# Altium project KSDK.PrjPCB
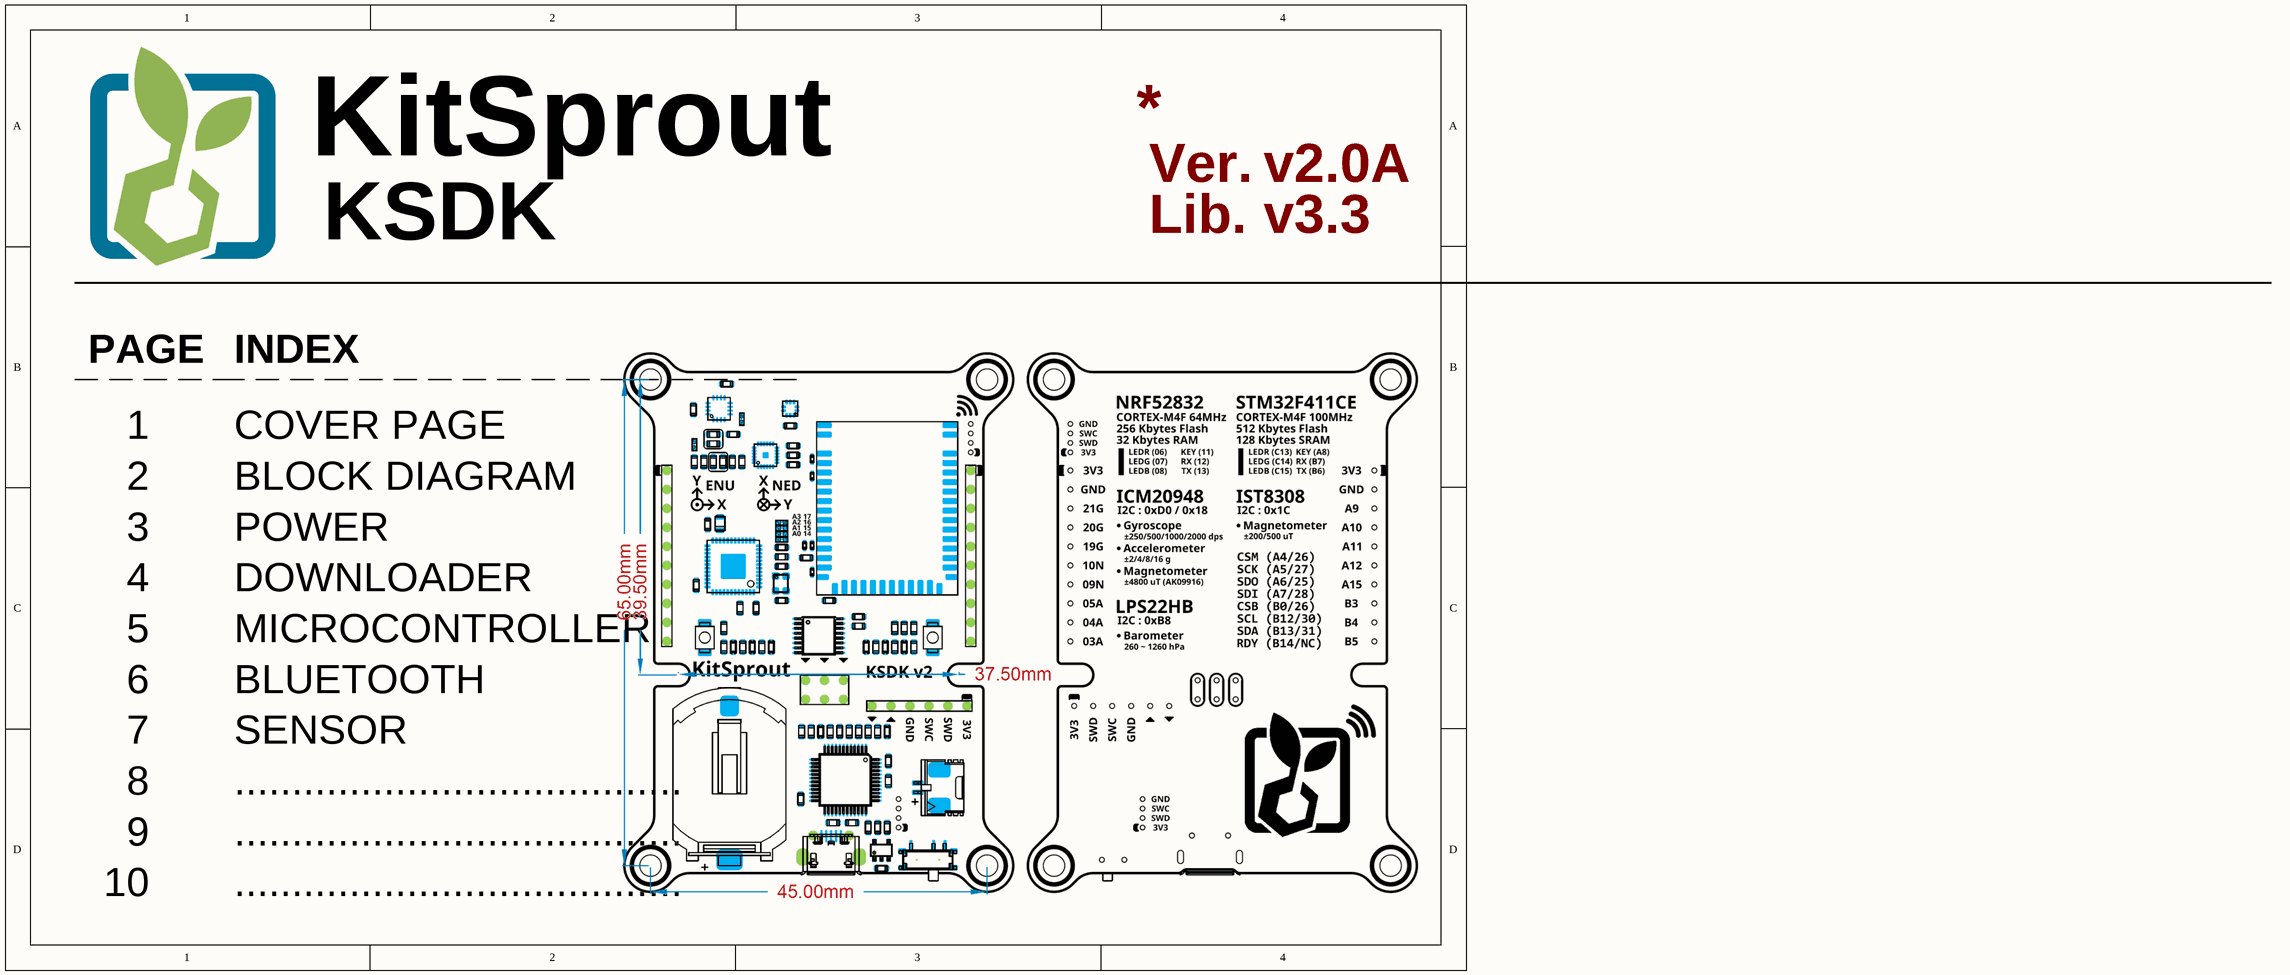
[diagram p0: [01] COVER PAGE.SchDoc]
7 sheets, 93 parts. Net scope: flat (ports and power ports of the same name join across sheets).
Board file: KSDK.PcbDoc
Sheets:
  [01] COVER PAGE.SchDoc
  [02] BLOCK DIAGRAM.SchDoc
    LDO = [03] POWER.SchDoc
    INERTIAL SENSOR = [07] SENSOR.SchDoc
    STM32 = [05] MICROCONTROLLER.SchDoc
    NRF52 = [06] BLUETOOTH.SchDoc
    DOWNLOADER = [04] DOWNLOADER.SchDoc

## Sheet [01] COVER PAGE.SchDoc: KSDK
size A4; Author: Hom; CompanyName: KitSprout; DrawnBy: Hom; Engineer: Hom; Organization: KitSprout; Revision: A; SheetNumber: 1; SheetTotal: 2; Version: v2.0A; LibVersion: v3.3

### Notes on the sheet
- Ver.
- ________________________________________________________________________
- Lib.
- _ _ _ _ _
- PAGE
- _ _ _ _ _ _ _ _ _ _ _ _ _ _ _ _ _
- INDEX
- 1
- COVER PAGE
- 2
- 3
- BLOCK DIAGRAM
- POWER
- 4
- DOWNLOADER
- 5
- MICROCONTROLLER
- 6
- BLUETOOTH
- 7
- 8
- SENSOR
- .......................................
- 9
- 10

## Sheet [02] BLOCK DIAGRAM.SchDoc: Template
size A4; Author: Hom; CompanyName: KitSprout; DrawnBy: Hom; Engineer: Hom; Organization: KitSprout; Revision: A; SheetNumber: 2; SheetTotal: 1; Version: 0.0; LibVersion: 0.0
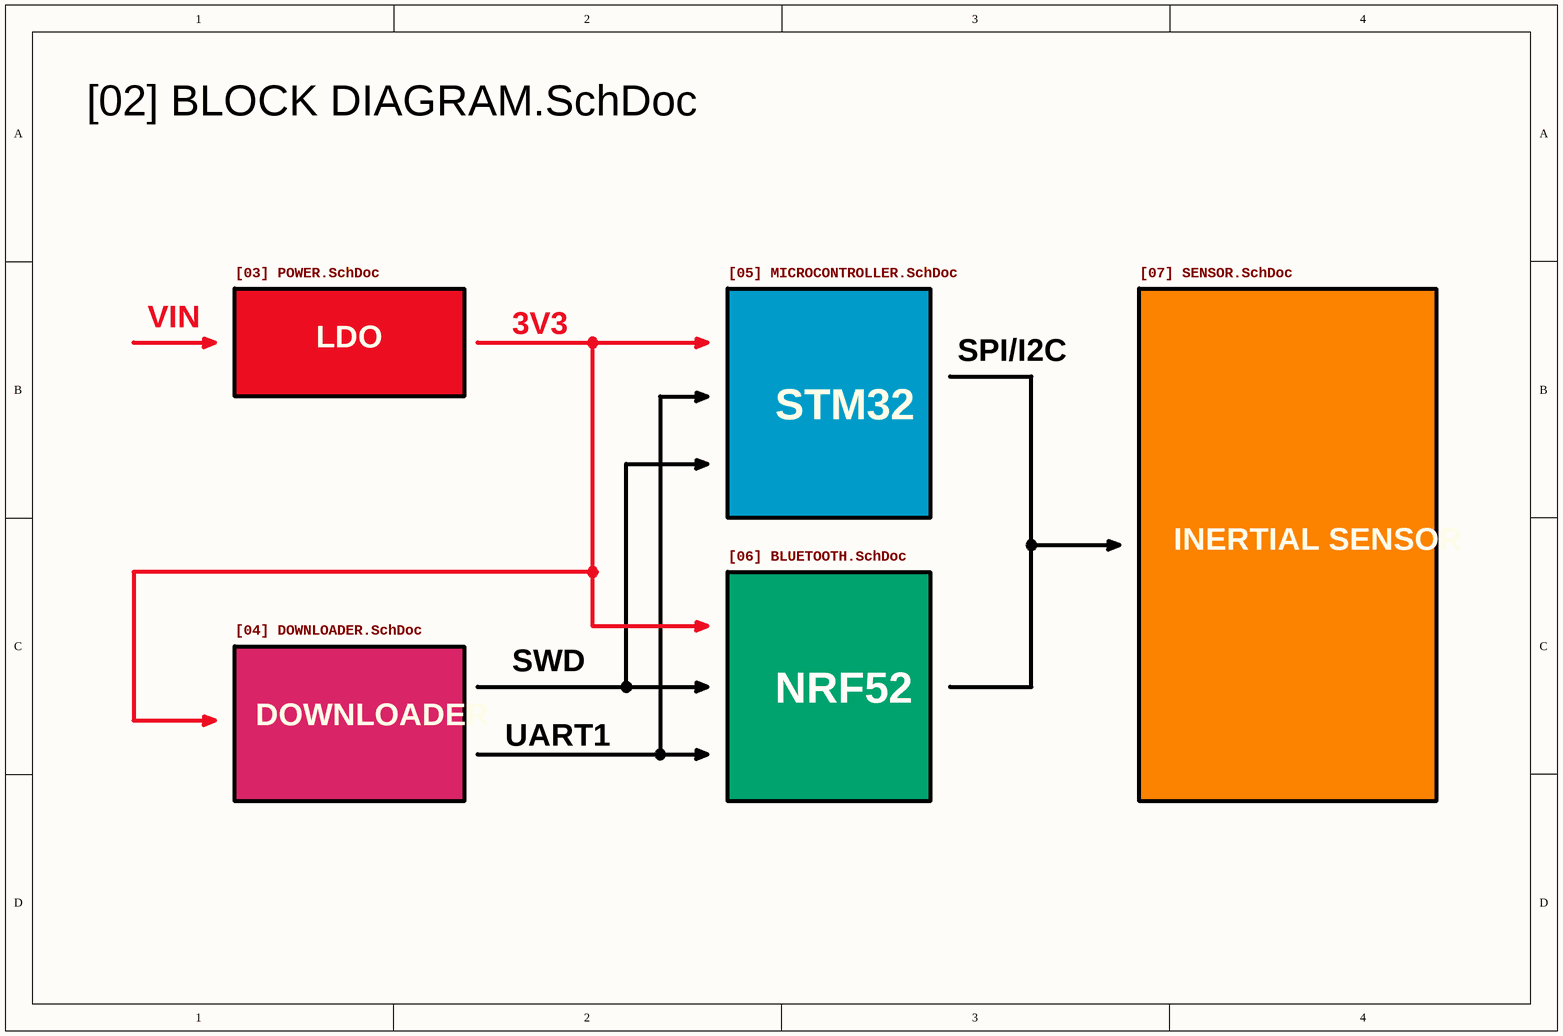
[diagram p1: [02] BLOCK DIAGRAM.SchDoc]

### Sub-sheets
DOWNLOADER = [04] DOWNLOADER.SchDoc: no entries
INERTIAL SENSOR = [07] SENSOR.SchDoc: no entries
LDO = [03] POWER.SchDoc: no entries
NRF52 = [06] BLUETOOTH.SchDoc: no entries
STM32 = [05] MICROCONTROLLER.SchDoc: no entries

### Notes on the sheet
- VIN
- 3V3
- SPI/I2C
- SWD
- UART1

## Sheet [03] POWER.SchDoc: Template
size A4; Author: Hom; CompanyName: KitSprout; DrawnBy: Hom; Engineer: Hom; Organization: KitSprout; Revision: A; SheetNumber: 3; SheetTotal: 6; Version: 0.0; LibVersion: 0.0
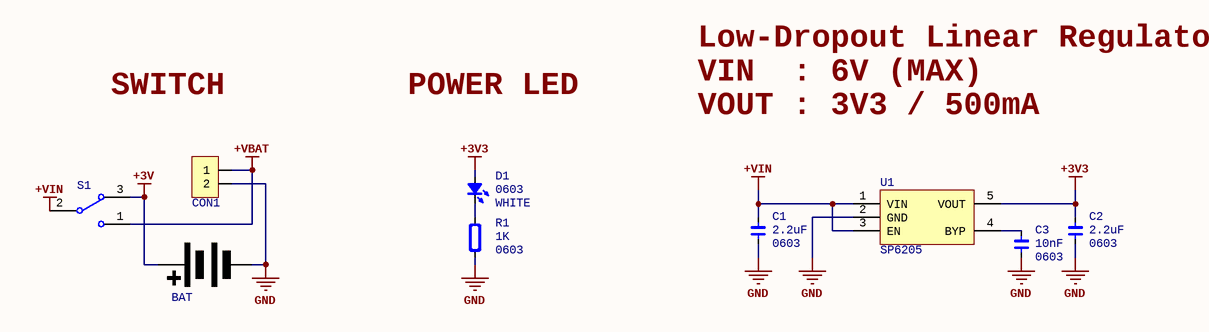
[diagram p2: [03] POWER.SchDoc]

### Parts
BAT  Battery  [CR2032-1]  (value not drawn)
C1  Type: 0603  [CAP_0603]  (hidden comment: 2.2uF)
C2  Type: 0603  [CAP_0603]  (hidden comment: 2.2uF)
C3  Type: 0603  [CAP_0603]  (hidden comment: 10nF)
CON1  MX1.25_2P  [MX1.25_S90_2P]  (value not drawn)
D1  Type: 0603  [LED_0603_YELLOW]  (hidden comment: WHITE)
R1  Type: 0603  [RES_0603]  (hidden comment: 1K)
S1  SPDT 3P  [SwitchSPDT_2.8X6.6_90]  (value not drawn)
U1  SP6205  [SOT23-5]

### Nets
+3V: BAT.2(+) S1.3
+3V3: C2.2 D1.1(A) U1.5(VOUT)
+VBAT: CON1.1 S1.1
+VIN: C1.2 S1.2 U1.1(VIN) U1.3(EN)
GND: BAT.1(-) C1.1 C2.1 C3.1 CON1.2 R1.1 U1.2(GND)
NetC3_2: C3.2 U1.4(BYP)
NetD1_2: D1.2(K) R1.2

### Notes on the sheet
- Low-Dropout Linear Regulator
- SWITCH
- POWER LED
- VIN  : 6V (MAX)
- VOUT : 3V3 / 500mA

### Library data of the parts
C1-C3 = Cap_0603: Capacitor
  C1 C2: Value: 2.2uF
  C3: Value: 10nF
CON1 = MX1.25_2P: MX
D1 = LED_0603: LED; Value: WHITE
R1 = Res_0603: Resistor; Value: 1K
S1 = SwitchSPDT_2.8x6.6_90: Switch; Value: SPDT 3P; Type: SPDT
U1 = SP6205: Power; Type: SOT23-5

## Sheet [07] SENSOR.SchDoc: Template
size A4; Author: Hom; CompanyName: KitSprout; DrawnBy: Hom; Engineer: Hom; Organization: KitSprout; Revision: A; SheetNumber: 6; SheetTotal: 6; Version: 0.0; LibVersion: 0.0
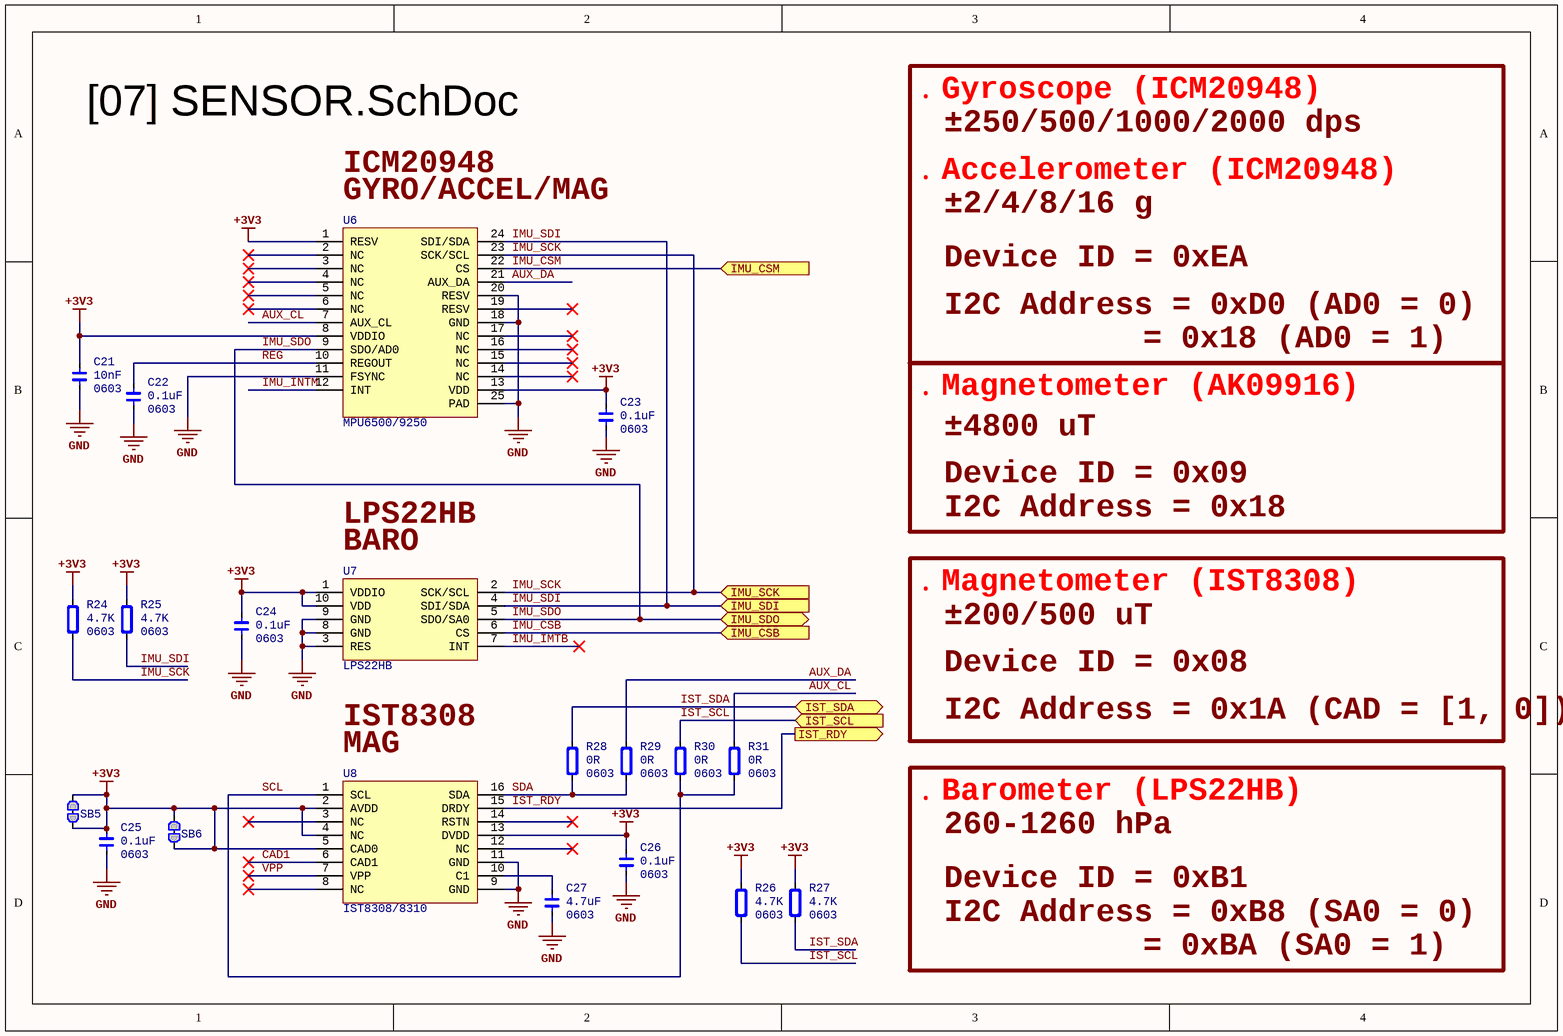
[diagram p3: [07] SENSOR.SchDoc]

### Parts
C21  Type: 0603  [CAP_0603]  (hidden comment: 10nF)
C22  Type: 0603  [CAP_0603]  (hidden comment: 0.1uF)
C23  Type: 0603  [CAP_0603]  (hidden comment: 0.1uF)
C24  Type: 0603  [CAP_0603]  (hidden comment: 0.1uF)
C25  Type: 0603  [CAP_0603]  (hidden comment: 0.1uF)
C26  Type: 0603  [CAP_0603]  (hidden comment: 0.1uF)
C27  Type: 0603  [CAP_0603]  (hidden comment: 4.7uF)
R24  Type: 0603  [RES_0603]  (hidden comment: 4.7K)
R25  Type: 0603  [RES_0603]  (hidden comment: 4.7K)
R26  Type: 0603  [RES_0603]  (hidden comment: 4.7K)
R27  Type: 0603  [RES_0603]  (hidden comment: 4.7K)
R28  Type: 0603  [RES_0603]  (hidden comment: 0R)
R29  Type: 0603  [RES_0603]  (hidden comment: 0R)
R30  Type: 0603  [RES_0603]  (hidden comment: 0R)
R31  Type: 0603  [RES_0603]  (hidden comment: 0R)
SB5  Solderbridge  [Solderbridge_Shorted]  (value not drawn)  (no BOM)
SB6  Solderbridge  [Solderbridge_Shorted]  (value not drawn)  (no BOM)
U6  MPU6500/9250  [QFN_P0.4_24]
U7  LPS22HB  [HCLGA-2x2_10]
U8  IST8308/8310  [QFN_P0.5_16]

### Ports
IMU_CSB (in), IMU_CSM (in), IMU_SCK (in), IMU_SDI (in), IMU_SDO, IST_RDY (out), IST_SCL (in), IST_SDA (bidir)

### Nets
+3V3: C21.2 C23.2 C24.2 C25.2 C26.2 R24.2 R25.2 R26.2 R27.2 SB5.1 SB5.2 SB6.1 SB6.2 U6.1(RESV) U6.8(VDDIO) U6.13(VDD) U7.1(VDDIO) U7.10(VDD) U8.2(AVDD) U8.4(NC) U8.5(CAD0) U8.13(DVDD)
GND: C21.1 C22.1 C23.1 C24.1 C25.1 C26.1 C27.1 U6.11(FSYNC) U6.18(GND) U6.20(RESV) U6.25(PAD) U7.3(RES) U7.8(GND) U7.9(GND) U8.9(GND) U8.11(GND)
AUX_CL: R31.2 U6.7(AUX_CL)
AUX_DA: R29.2 U6.21(AUX_DA)
CAD1: U8.6(CAD1)
IMU_CSB: U7.6(CS) ; port IMU_CSB
IMU_CSM: U6.22(CS) ; port IMU_CSM
IMU_IMTB: U7.7(INT)
IMU_INTM: U6.12(INT)
IMU_SCK: R24.1 U6.23(SCK/SCL) U7.2(SCK/SCL) ; port IMU_SCK
IMU_SDI: R25.1 U6.24(SDI/SDA) U7.4(SDI/SDA) ; port IMU_SDI
IMU_SDO: U6.9(SDO/AD0) U7.5(SDO/SA0) ; port IMU_SDO
IST_RDY: U8.15(DRDY) ; port IST_RDY
IST_SCL: R26.1 R30.2 ; port IST_SCL
IST_SDA: R27.1 R28.2 ; port IST_SDA
REG: C22.2 U6.10(REGOUT)
SCL: R30.1 R31.1 U8.1(SCL)
SDA: R28.1 R29.1 U8.16(SDA)
VPP: U8.7(VPP)
NetC27_2: C27.2 U8.10(C1)

Not connected (* = marked no-connect by the designer): U6 2(NC)* 3(NC)* 4(NC)* 5(NC)* 6(NC)* 14(NC)* 15(NC)* 16(NC)* 17(NC)* 19(RESV)*; U8 3(NC)* 8(NC)* 12(NC)* 14(RSTN)*

### Notes on the sheet
- ．Gyroscope (ICM20948)
- ICM20948
- ±250/500/1000/2000 dps
- (near U6) GYRO/ACCEL/MAG
- ．Accelerometer (ICM20948)
- ±2/4/8/16 g
- Device ID = 0xEA
- I2C Address = 0xD0 (AD0 = 0)
- = 0x18 (AD0 = 1)
- ．Magnetometer (AK09916)
- ±4800 uT
- I2C Address = 0x18
- Device ID = 0x09
- LPS22HB
- (near U7) BARO
- ．Magnetometer (IST8308)
- ±200/500 uT
- Device ID = 0x08
- IST8308
- (near U8) MAG
- I2C Address = 0x1A (CAD = [1, 0])
- ．Barometer (LPS22HB)
- 260-1260 hPa
- Device ID = 0xB1
- I2C Address = 0xB8 (SA0 = 0)
- = 0xBA (SA0 = 1)

### Library data of the parts
C21-C27 = Cap_0603: Capacitor
  C21: Value: 10nF
  C22-C26: Value: 0.1uF
  C27: Value: 4.7uF
R24-R31 = Res_0603: Resistor
  R24-R27: Value: 4.7K
  R28-R31: Value: 0R
SB5 SB6 = Shorted Solderbridge: Value: Solderbridge
U6 = MPU925x: Sensor Motion; Type: QFN24 P0.4
U7 = LPS22HB: Sensor Pressure; Type: LGA10 P0.5
U8 = IST8310: Sensor Magnetometer; Type: QFN16 P0.5

## Sheet [05] MICROCONTROLLER.SchDoc: Template
size A4; Author: Hom; CompanyName: KitSprout; DrawnBy: Hom; Engineer: Hom; Organization: KitSprout; Revision: A; SheetNumber: 5; SheetTotal: 6; Version: 0.0; LibVersion: 0.0
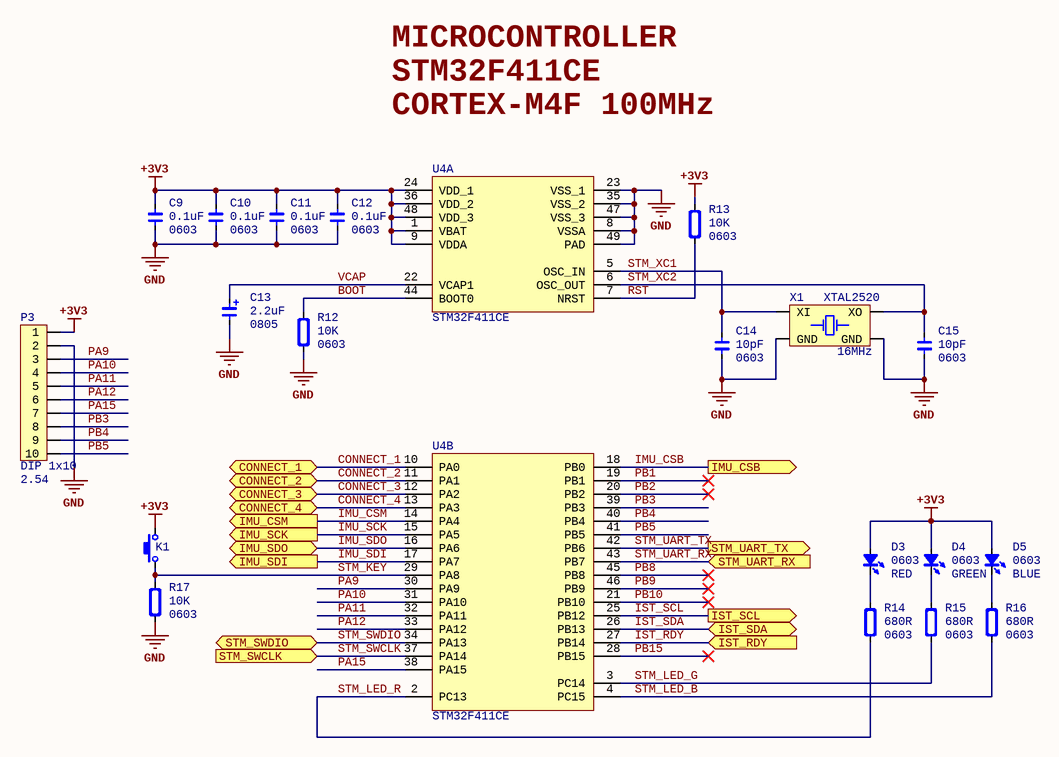
[diagram p4: [05] MICROCONTROLLER.SchDoc]

### Parts
C9  Type: 0603  [CAP_0603]  (hidden comment: 0.1uF)
C10  Type: 0603  [CAP_0603]  (hidden comment: 0.1uF)
C11  Type: 0603  [CAP_0603]  (hidden comment: 0.1uF)
C12  Type: 0603  [CAP_0603]  (hidden comment: 0.1uF)
C13  Type: 0805  [CAP_TAN_P0805]  (hidden comment: 2.2uF)
C14  Type: 0603  [CAP_0603]  (hidden comment: 10pF)
C15  Type: 0603  [CAP_0603]  (hidden comment: 10pF)
D3  Type: 0603  [LED_0603_RED]  (hidden comment: RED)
D4  Type: 0603  [LED_0603_GREEN]  (hidden comment: GREEN)
D5  Type: 0603  [LED_0603_BLUE]  (hidden comment: BLUE)
K1  ButtonTACT  [ButtonTACT_3x4x2_180H]  (value not drawn)
P3  value 2.54  [HDR1X10_2.54_180]  (hidden comment: DIP 1x10)
R12  Type: 0603  [RES_0603]  (hidden comment: 10K)
R13  Type: 0603  [RES_0603]  (hidden comment: 10K)
R14  Type: 0603  [RES_0603]  (hidden comment: 680R)
R15  Type: 0603  [RES_0603]  (hidden comment: 680R)
R16  Type: 0603  [RES_0603]  (hidden comment: 680R)
R17  Type: 0603  [RES_0603]  (hidden comment: 10K)
U4  STM32F411CE  [QFN_P0.5_48]  (parts A,B of 2)
X1  Type: XTAL2520  [XT_2520_4]  (hidden comment: 16MHz)

### Ports
CONNECT_1, CONNECT_2, CONNECT_3, CONNECT_4, IMU_CSB (out), IMU_CSM (out), IMU_SCK (out), IMU_SDI (out), IMU_SDO, IST_RDY (in), IST_SCL (out), IST_SDA (bidir), STM_SWCLK (in), STM_SWDIO (bidir), STM_UART_RX (in), STM_UART_TX (out)

### Nets
+3V3: C9.2 C10.2 C11.2 C12.2 D3.1(A) D4.1(A) D5.1(A) K1.2 P3.1 R13.2 U4.1(VBAT) U4.9(VDDA) U4.24(VDD_1) U4.36(VDD_2) U4.48(VDD_3)
GND: C9.1 C10.1 C11.1 C12.1 C13.2 C14.1 C15.1 P3.2 R12.1 R17.1 U4.8(VSSA) U4.23(VSS_1) U4.35(VSS_2) U4.47(VSS_3) U4.49(PAD) X1.2(GND) X1.4(GND)
BOOT: R12.2 U4.44(BOOT0)
CONNECT_1: U4.10(PA0) ; port CONNECT_1
CONNECT_2: U4.11(PA1) ; port CONNECT_2
CONNECT_3: U4.12(PA2) ; port CONNECT_3
CONNECT_4: U4.13(PA3) ; port CONNECT_4
IMU_CSB: U4.18(PB0) ; port IMU_CSB
IMU_CSM: U4.14(PA4) ; port IMU_CSM
IMU_SCK: U4.15(PA5) ; port IMU_SCK
IMU_SDI: U4.17(PA7) ; port IMU_SDI
IMU_SDO: U4.16(PA6) ; port IMU_SDO
IST_RDY: U4.27(PB14) ; port IST_RDY
IST_SCL: U4.25(PB12) ; port IST_SCL
IST_SDA: U4.26(PB13) ; port IST_SDA
PA9: P3.3 U4.30(PA9)
PA10: P3.4 U4.31(PA10)
PA11: P3.5 U4.32(PA11)
PA12: P3.6 U4.33(PA12)
PA15: P3.7 U4.38(PA15)
PB1: U4.19(PB1)
PB2: U4.20(PB2)
PB3: P3.8 U4.39(PB3)
PB4: P3.9 U4.40(PB4)
PB5: P3.10 U4.41(PB5)
PB8: U4.45(PB8)
PB9: U4.46(PB9)
PB10: U4.21(PB10)
PB15: U4.28(PB15)
RST: R13.1 U4.7(NRST)
STM_KEY: K1.1 R17.2 U4.29(PA8)
STM_LED_B: R16.1 U4.4(PC15)
STM_LED_G: R15.1 U4.3(PC14)
STM_LED_R: R14.1 U4.2(PC13)
STM_SWCLK: U4.37(PA14) ; port STM_SWCLK
STM_SWDIO: U4.34(PA13) ; port STM_SWDIO
STM_UART_RX: U4.43(PB7) ; port STM_UART_RX
STM_UART_TX: U4.42(PB6) ; port STM_UART_TX
STM_XC1: C14.2 U4.5(OSC_IN) X1.1(XI)
STM_XC2: C15.2 U4.6(OSC_OUT) X1.3(XO)
VCAP: C13.1 U4.22(VCAP1)
NetD3_2: D3.2(K) R14.2
NetD4_2: D4.2(K) R15.2
NetD5_2: D5.2(K) R16.2

### Notes on the sheet
- MICROCONTROLLER
- STM32F411CE
- CORTEX-M4F 100MHz

### Library data of the parts
C9-C12 C14 C15 = Cap_0603: Capacitor
  C9-C12: Value: 0.1uF
  C14 C15: Value: 10pF
C13 = Cap_Tan_0805: Capacitor Tantalum; Value: 2.2uF
D3-D5 = LED_0603: LED
  D3: Value: RED
  D4: Value: GREEN
  D5: Value: BLUE
K1 = ButtonTACT_3x4x2_180: Button; Value: ButtonTACT
P3 = HDR1x10_2.54T: Header; Type: DIP 1x10
R12-R17 = Res_0603: Resistor
  R12 R13 R17: Value: 10K
  R14-R16: Value: 680R
U4 = STM32F4x1C: MCU; Type: QFN48 P0.5
X1 = XTAL_2520_4P: Crystal Oscillator; Value: 16MHz

## Sheet [06] BLUETOOTH.SchDoc: Template
size A4; Author: Hom; CompanyName: KitSprout; DrawnBy: Hom; Engineer: Hom; Organization: KitSprout; Revision: A; SheetNumber: 5; SheetTotal: 6; Version: 0.0; LibVersion: 0.0
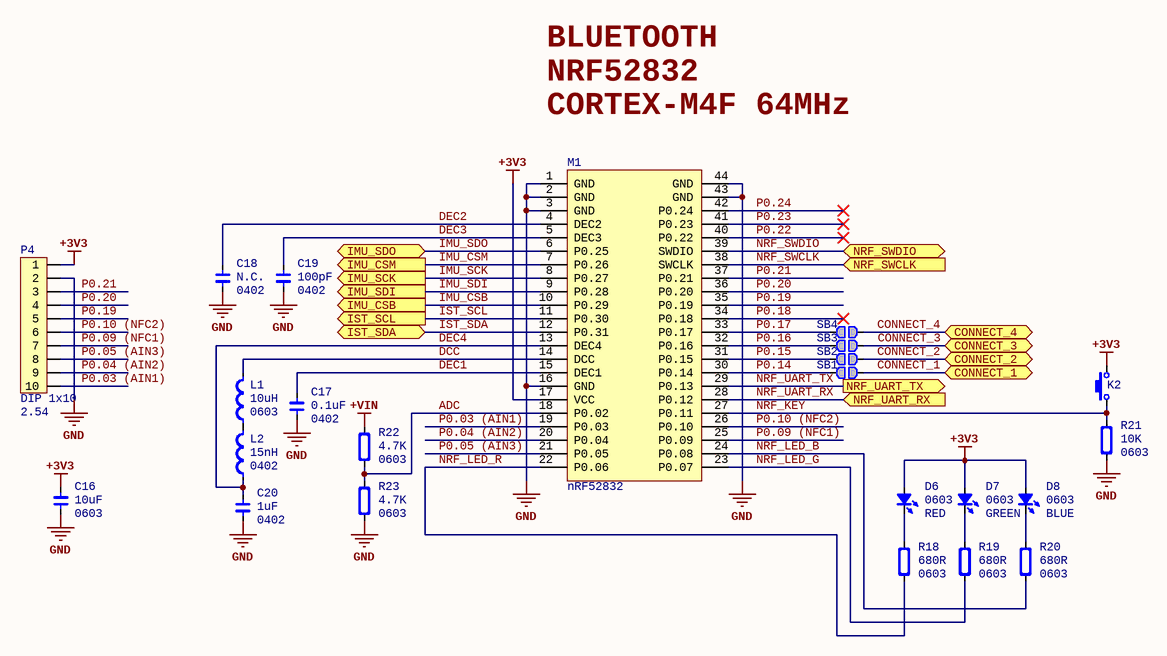
[diagram p5: [06] BLUETOOTH.SchDoc]

### Parts
C16  Type: 0603  [CAP_0603]  (hidden comment: 10uF)
C17  Type: 0402  [CAP_0402]  (hidden comment: 0.1uF)
C18  Type: 0402  [CAP_0402]  (hidden comment: N.C.)
C19  Type: 0402  [CAP_0402]  (hidden comment: 100pF)
C20  Type: 0402  [CAP_0402]  (hidden comment: 1uF)
D6  Type: 0603  [LED_0603_RED]  (hidden comment: RED)
D7  Type: 0603  [LED_0603_GREEN]  (hidden comment: GREEN)
D8  Type: 0603  [LED_0603_BLUE]  (hidden comment: BLUE)
K2  ButtonTACT  [ButtonTACT_3x4x2_180H]  (value not drawn)
L1  Type: 0603  [IND_0603]  (hidden comment: 10uH)
L2  Type: 0402  [IND_0402]  (hidden comment: 15nH)
M1  value nRF52832  [E73-2G4M04S]  (hidden comment: BT_E73-2G4M04S)
P4  value 2.54  [HDR1X10_2.54_180]  (hidden comment: DIP 1x10)
R18  Type: 0603  [RES_0603]  (hidden comment: 680R)
R19  Type: 0603  [RES_0603]  (hidden comment: 680R)
R20  Type: 0603  [RES_0603]  (hidden comment: 680R)
R21  Type: 0603  [RES_0603]  (hidden comment: 10K)
R22  Type: 0603  [RES_0603]  (hidden comment: 4.7K)
R23  Type: 0603  [RES_0603]  (hidden comment: 4.7K)
SB1  Solderbridge  [Solderbridge]  (value not drawn)  (no BOM)
SB2  Solderbridge  [Solderbridge]  (value not drawn)  (no BOM)
SB3  Solderbridge  [Solderbridge]  (value not drawn)  (no BOM)
SB4  Solderbridge  [Solderbridge]  (value not drawn)  (no BOM)

### Ports
CONNECT_1, CONNECT_2, CONNECT_3, CONNECT_4, IMU_CSB (out), IMU_CSM (out), IMU_SCK (out), IMU_SDI (out), IMU_SDO, IST_SCL (out), IST_SDA (bidir), NRF_SWCLK (in), NRF_SWDIO (bidir), NRF_UART_RX (in), NRF_UART_TX (out)

### Nets
+3V3: C16.2 D6.1(A) D7.1(A) D8.1(A) K2.2 M1.17(VCC) P4.1
+VIN: R22.2
GND: C16.1 C17.1 C18.1 C19.1 C20.1 M1.1(GND) M1.2(GND) M1.3(GND) M1.16(GND) M1.43(GND) M1.44(GND) P4.2 R21.1 R23.1
ADC: M1.18(P0.02) R22.1 R23.2
CONNECT_1: SB1.2 ; port CONNECT_1
CONNECT_2: SB2.2 ; port CONNECT_2
CONNECT_3: SB3.2 ; port CONNECT_3
CONNECT_4: SB4.2 ; port CONNECT_4
DCC: L1.2 M1.14(DCC)
DEC1: C17.2 M1.15(DEC1)
DEC2: C18.2 M1.4(DEC2)
DEC3: C19.2 M1.5(DEC3)
DEC4: C20.2 L2.1 M1.13(DEC4)
IMU_CSB: M1.10(P0.29) ; port IMU_CSB
IMU_CSM: M1.7(P0.26) ; port IMU_CSM
IMU_SCK: M1.8(P0.27) ; port IMU_SCK
IMU_SDI: M1.9(P0.28) ; port IMU_SDI
IMU_SDO: M1.6(P0.25) ; port IMU_SDO
IST_SCL: M1.11(P0.30) ; port IST_SCL
IST_SDA: M1.12(P0.31) ; port IST_SDA
NRF_KEY: K2.1 M1.27(P0.11) R21.2
NRF_LED_B: M1.24(P0.08) R20.1
NRF_LED_G: M1.23(P0.07) R19.1
NRF_LED_R: M1.22(P0.06) R18.1
NRF_SWCLK: M1.38(SWCLK) ; port NRF_SWCLK
NRF_SWDIO: M1.39(SWDIO) ; port NRF_SWDIO
NRF_UART_RX: M1.28(P0.12) ; port NRF_UART_RX
NRF_UART_TX: M1.29(P0.13) ; port NRF_UART_TX
P0.03 (AIN1): M1.19(P0.03) P4.10
P0.04 (AIN2): M1.20(P0.04) P4.9
P0.05 (AIN3): M1.21(P0.05) P4.8
P0.09 (NFC1): M1.25(P0.09) P4.7
P0.10 (NFC2): M1.26(P0.10) P4.6
P0.14: M1.30(P0.14) SB1.1
P0.15: M1.31(P0.15) SB2.1
P0.16: M1.32(P0.16) SB3.1
P0.17: M1.33(P0.17) SB4.1
P0.18: M1.34(P0.18)
P0.19: M1.35(P0.19) P4.5
P0.20: M1.36(P0.20) P4.4
P0.21: M1.37(P0.21) P4.3
P0.22: M1.40(P0.22)
P0.23: M1.41(P0.23)
P0.24: M1.42(P0.24)
NetD6_2: D6.2(K) R18.2
NetD7_2: D7.2(K) R19.2
NetD8_2: D8.2(K) R20.2
NetL1_1: L1.1 L2.2

### Notes on the sheet
- BLUETOOTH
- NRF52832
- CORTEX-M4F 64MHz

### Library data of the parts
C16 = Cap_0603: Capacitor; Value: 10uF
C17-C20 = Cap_0402: Capacitor
  C17: Value: 0.1uF
  C18: Value: N.C.
  C19: Value: 100pF
  C20: Value: 1uF
D6-D8 = LED_0603: LED
  D6: Value: RED
  D7: Value: GREEN
  D8: Value: BLUE
K2 = ButtonTACT_3x4x2_180: Button; Value: ButtonTACT
L1 = Ind_0603: Inductor; Value: 10uH
L2 = Ind_0402: Inductor; Value: 15nH
M1 = BT_E73-2G4M04S: Module
P4 = HDR1x10_2.54T: Header; Type: DIP 1x10
R18-R23 = Res_0603: Resistor
  R18-R20: Value: 680R
  R21: Value: 10K
  R22 R23: Value: 4.7K
SB1-SB4 = Solderbridge: Value: Solderbridge

## Sheet [04] DOWNLOADER.SchDoc: Template
size A4; Author: Hom; CompanyName: KitSprout; DrawnBy: Hom; Engineer: Hom; Organization: KitSprout; Revision: A; SheetNumber: 4; SheetTotal: 6; Version: 0.0; LibVersion: 0.0
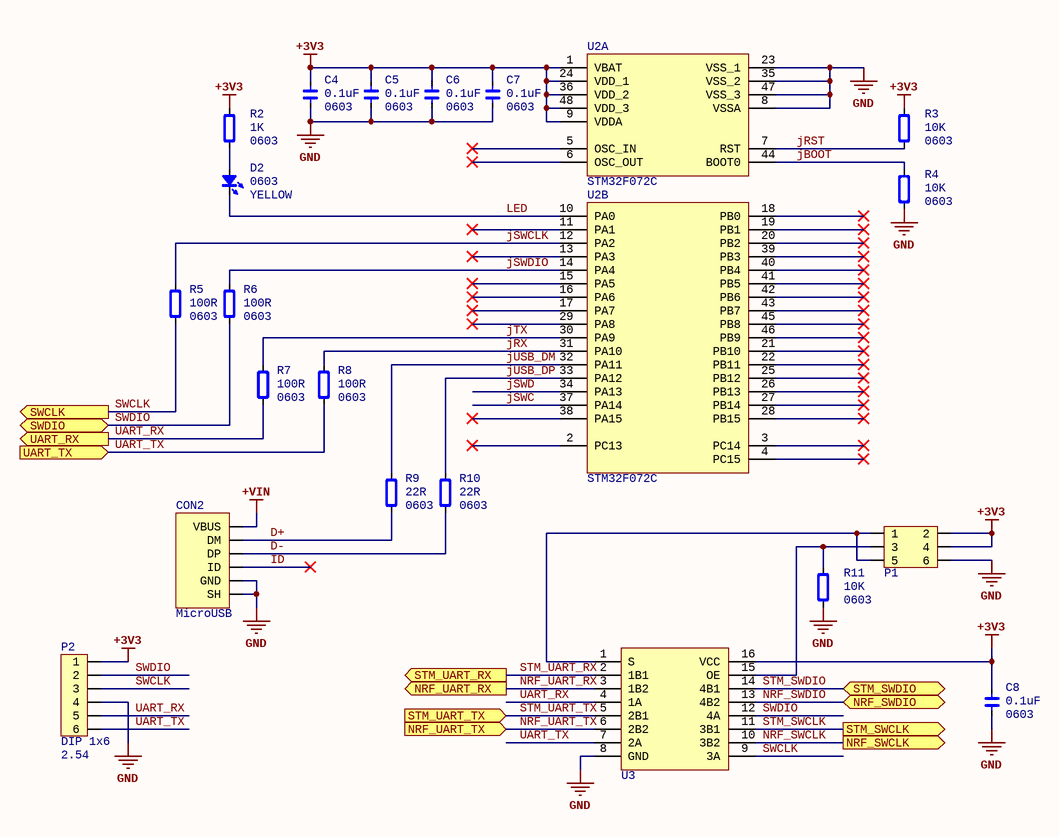
[diagram p6: [04] DOWNLOADER.SchDoc]

### Parts
C4  Type: 0603  [CAP_0603]  (hidden comment: 0.1uF)
C5  Type: 0603  [CAP_0603]  (hidden comment: 0.1uF)
C6  Type: 0603  [CAP_0603]  (hidden comment: 0.1uF)
C7  Type: 0603  [CAP_0603]  (hidden comment: 0.1uF)
C8  Type: 0603  [CAP_0603]  (hidden comment: 0.1uF)
CON2  MicroUSB  [USB_Micro-AB]
D2  Type: 0603  [LED_0603_ORANGE]  (hidden comment: YELLOW)
P1  HDR2x3_2.54  [HDR2X3_2.54_180]  (value not drawn)
P2  value 2.54  [HDR1X6_2.54_180]  (hidden comment: DIP 1x6)
R2  Type: 0603  [RES_0603]  (hidden comment: 1K)
R3  Type: 0603  [RES_0603]  (hidden comment: 10K)
R4  Type: 0603  [RES_0603]  (hidden comment: 10K)
R5  Type: 0603  [RES_0603]  (hidden comment: 100R)
R6  Type: 0603  [RES_0603]  (hidden comment: 100R)
R7  Type: 0603  [RES_0603]  (hidden comment: 100R)
R8  Type: 0603  [RES_0603]  (hidden comment: 100R)
R9  Type: 0603  [RES_0603]  (hidden comment: 22R)
R10  Type: 0603  [RES_0603]  (hidden comment: 22R)
R11  Type: 0603  [RES_0603]  (hidden comment: 10K)
U2  STM32F072C  [LQFP_P0.5_48]  (parts A,B of 2)
U3  SN74CB3Q3257  [TSSOP_E170_P0.65_16]  (value not drawn)

### Ports
NRF_SWCLK (out), NRF_SWDIO (bidir), NRF_UART_RX (out), NRF_UART_TX (in), STM_SWCLK (out), STM_SWDIO (bidir), STM_UART_RX (out), STM_UART_TX (in), SWCLK (out), SWDIO (bidir), UART_RX (out), UART_TX (in)

### Nets
+3V3: C4.2 C5.2 C6.2 C7.2 C8.2 P1.2 P1.4 P2.1 R2.2 R3.2 U2.1(VBAT) U2.9(VDDA) U2.24(VDD_1) U2.36(VDD_2) U2.48(VDD_3) U3.16(VCC)
+VIN: CON2.1(VBUS)
GND: C4.1 C5.1 C6.1 C7.1 C8.1 CON2.0(SH) CON2.5(GND) P1.6 P2.4 R4.1 R11.1 U2.8(VSSA) U2.23(VSS_1) U2.35(VSS_2) U2.47(VSS_3) U3.8(GND)
D+: CON2.2(DM) R9.1
D-: CON2.3(DP) R10.1
ID: CON2.4(ID)
jBOOT: R4.2 U2.44(BOOT0)
jRST: R3.1 U2.7(RST)
jRX: R8.1 U2.31(PA10)
jSWC: U2.37(PA14)
jSWCLK: R5.1 U2.12(PA2)
jSWD: U2.34(PA13)
jSWDIO: R6.1 U2.14(PA4)
jTX: R7.1 U2.30(PA9)
jUSB_DM: R9.2 U2.32(PA11)
jUSB_DP: R10.2 U2.33(PA12)
LED: D2.2(K) U2.10(PA0)
NRF_SWCLK: U3.10(3B2) ; port NRF_SWCLK
NRF_SWDIO: U3.13(4B2) ; port NRF_SWDIO
NRF_UART_RX: U3.3(1B2) ; port NRF_UART_RX
NRF_UART_TX: U3.6(2B2) ; port NRF_UART_TX
STM_SWCLK: U3.11(3B1) ; port STM_SWCLK
STM_SWDIO: U3.14(4B1) ; port STM_SWDIO
STM_UART_RX: U3.2(1B1) ; port STM_UART_RX
STM_UART_TX: U3.5(2B1) ; port STM_UART_TX
SWCLK: P2.3 R5.2 U3.9(3A) ; port SWCLK
SWDIO: P2.2 R6.2 U3.12(4A) ; port SWDIO
UART_RX: P2.5 R7.2 U3.4(1A) ; port UART_RX
UART_TX: P2.6 R8.2 U3.7(2A) ; port UART_TX
NetD2_1: D2.1(A) R2.1
NetP1_1: P1.1 P1.5 U3.1(S)
NetP1_3: P1.3 R11.2 U3.15(OE)

Not connected (* = marked no-connect by the designer): U2 2(PC13)* 3(PC14)* 4(PC15)* 5(OSC_IN)* 6(OSC_OUT)* 11(PA1)* 13(PA3)* 15(PA5)* 16(PA6)* 17(PA7)* 18(PB0)* 19(PB1)* 20(PB2)* 21(PB10)* 22(PB11)* 25(PB12)* 26(PB13)* 27(PB14)* 28(PB15)* 29(PA8)* 38(PA15)* 39(PB3)* 40(PB4)* 41(PB5)* 42(PB6)* 43(PB7)* 45(PB8)* 46(PB9)*

### Library data of the parts
C4-C8 = Cap_0603: Capacitor; Value: 0.1uF
CON2 = USB_Micro: USB
D2 = LED_0603: LED; Value: YELLOW
P1 = HDR2x3_2.54: Header
P2 = HDR1x6_2.54T: Header; Type: DIP 1x6
R2-R11 = Res_0603: Resistor
  R2: Value: 1K
  R3 R4 R11: Value: 10K
  R5-R8: Value: 100R
  R9 R10: Value: 22R
U2 = STM32F103C: MCU; Type: LQFP48 P0.5
U3 = SN74CB3Q3257: Switch; Type: TSSOP16 P0.65

## Nets that join several sheets
+3V3: [03] POWER (C2.2 D1.1 U1.5), [07] SENSOR (22 pins), [05] MICROCONTROLLER (15 pins), [06] BLUETOOTH (7 pins), [04] DOWNLOADER (16 pins)
+VIN: [03] POWER (C1.2 S1.2 U1.1 U1.3), [06] BLUETOOTH (R22.2), [04] DOWNLOADER (CON2.1)
GND: [03] POWER (7 pins), [07] SENSOR (16 pins), [05] MICROCONTROLLER (17 pins), [06] BLUETOOTH (14 pins), [04] DOWNLOADER (16 pins)
CONNECT_1: [05] MICROCONTROLLER (U4.10), [06] BLUETOOTH (SB1.2)
CONNECT_2: [05] MICROCONTROLLER (U4.11), [06] BLUETOOTH (SB2.2)
CONNECT_3: [05] MICROCONTROLLER (U4.12), [06] BLUETOOTH (SB3.2)
CONNECT_4: [05] MICROCONTROLLER (U4.13), [06] BLUETOOTH (SB4.2)
IMU_CSB: [07] SENSOR (U7.6), [05] MICROCONTROLLER (U4.18), [06] BLUETOOTH (M1.10)
IMU_CSM: [07] SENSOR (U6.22), [05] MICROCONTROLLER (U4.14), [06] BLUETOOTH (M1.7)
IMU_SCK: [07] SENSOR (R24.1 U6.23 U7.2), [05] MICROCONTROLLER (U4.15), [06] BLUETOOTH (M1.8)
IMU_SDI: [07] SENSOR (R25.1 U6.24 U7.4), [05] MICROCONTROLLER (U4.17), [06] BLUETOOTH (M1.9)
IMU_SDO: [07] SENSOR (U6.9 U7.5), [05] MICROCONTROLLER (U4.16), [06] BLUETOOTH (M1.6)
IST_RDY: [07] SENSOR (U8.15), [05] MICROCONTROLLER (U4.27)
IST_SCL: [07] SENSOR (R26.1 R30.2), [05] MICROCONTROLLER (U4.25), [06] BLUETOOTH (M1.11)
IST_SDA: [07] SENSOR (R27.1 R28.2), [05] MICROCONTROLLER (U4.26), [06] BLUETOOTH (M1.12)
NRF_SWCLK: [06] BLUETOOTH (M1.38), [04] DOWNLOADER (U3.10)
NRF_SWDIO: [06] BLUETOOTH (M1.39), [04] DOWNLOADER (U3.13)
NRF_UART_RX: [06] BLUETOOTH (M1.28), [04] DOWNLOADER (U3.3)
NRF_UART_TX: [06] BLUETOOTH (M1.29), [04] DOWNLOADER (U3.6)
STM_SWCLK: [05] MICROCONTROLLER (U4.37), [04] DOWNLOADER (U3.11)
STM_SWDIO: [05] MICROCONTROLLER (U4.34), [04] DOWNLOADER (U3.14)
STM_UART_RX: [05] MICROCONTROLLER (U4.43), [04] DOWNLOADER (U3.2)
STM_UART_TX: [05] MICROCONTROLLER (U4.42), [04] DOWNLOADER (U3.5)